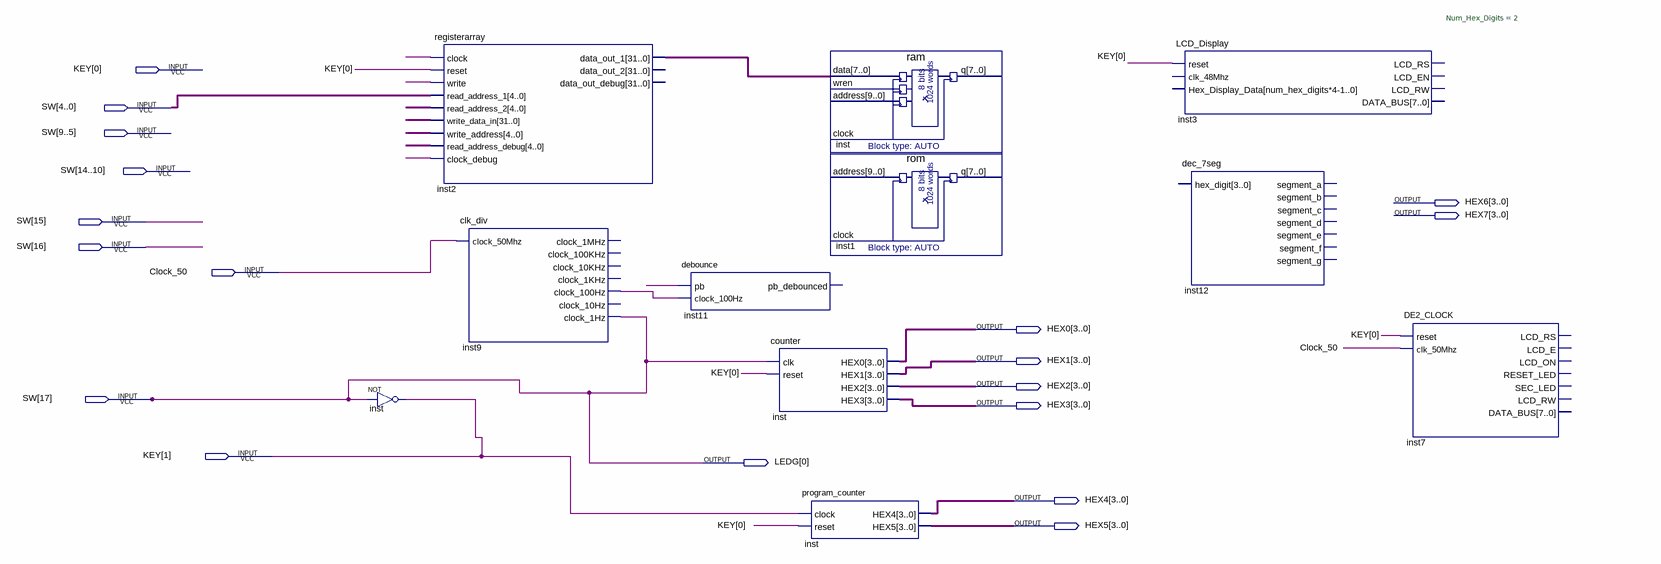
[diagram p0: schematic sheet]
// Quartus schematic Block Diagram.bdf as structural Verilog: 11 symbols, 18 pins
module \Block_Diagram  (
  input  [1:0] KEY,
  input  [17:0] SW,
  input  Clock_50,
  output [3:0] HEX6,
  output [3:0] HEX7,
  output [3:0] HEX0,
  output [3:0] HEX1,
  output [3:0] HEX2,
  output [3:0] HEX3,
  output [0:0] LEDG,
  output [3:0] HEX4,
  output [3:0] HEX5
);

  wire inst9_clock_100hz, undriven, undriven_6, undriven_7, undriven_8;
  wire [4:0] undriven_2, undriven_3, undriven_5;
  wire [31:0] inst2_data_out_1, undriven_4;

  not inst (KEY[1], SW[17]);
  registerarray inst2 (
    .clock(undriven_7), .reset(KEY[0]), .write(undriven_6), .read_address_1(SW[4:0]),
    .read_address_2(undriven_5), .write_data_in(undriven_4), .write_address(undriven_3),
    .read_address_debug(undriven_2), .clock_debug(undriven), .data_out_1(inst2_data_out_1));  // open: data_out_2, data_out_debug
  clk_div inst9 (
    .clock_50Mhz(Clock_50), .clock_100Hz(inst9_clock_100hz), .clock_1Hz(SW[17]));  // open: clock_1MHz, clock_100KHz, clock_10KHz, clock_1KHz, clock_10Hz
  debounce inst11 (.pb(undriven_8), .clock_100Hz(inst9_clock_100hz));  // open: pb_debounced
  counter inst_dup2 (.clk(SW[17]), .reset(KEY[0]), .HEX0(HEX0), .HEX1(HEX1), .HEX2(HEX2), .HEX3(HEX3));
  program_counter inst_dup3 (.clock(KEY[1]), .reset(KEY[0]), .HEX4(HEX4), .HEX5(HEX5));
  ram inst_dup4 (.data(inst2_data_out_1));  // open: wren, address, clock, q
  rom inst1 ();  // open: address, clock, q
  LCD_Display #(.Num_Hex_Digits(2)) inst3 (.reset(KEY[0]));  // open: clk_48Mhz, Hex_Display_Data, LCD_RS, LCD_EN, LCD_RW, DATA_BUS
  dec_7seg inst12 ();  // open: hex_digit, segment_a, segment_b, segment_c, segment_d, segment_e, segment_f, segment_g
  DE2_CLOCK inst7 (
    .reset(KEY[0]), .clk_50Mhz(Clock_50));  // open: LCD_RS, LCD_E, LCD_ON, RESET_LED, SEC_LED, LCD_RW, DATA_BUS

  assign LEDG[0] = SW[17];
endmodule
